# EAGLE design Controller_high_power_v1.0 (EAGLE 9.3.0)

## Sheet 1 of 2
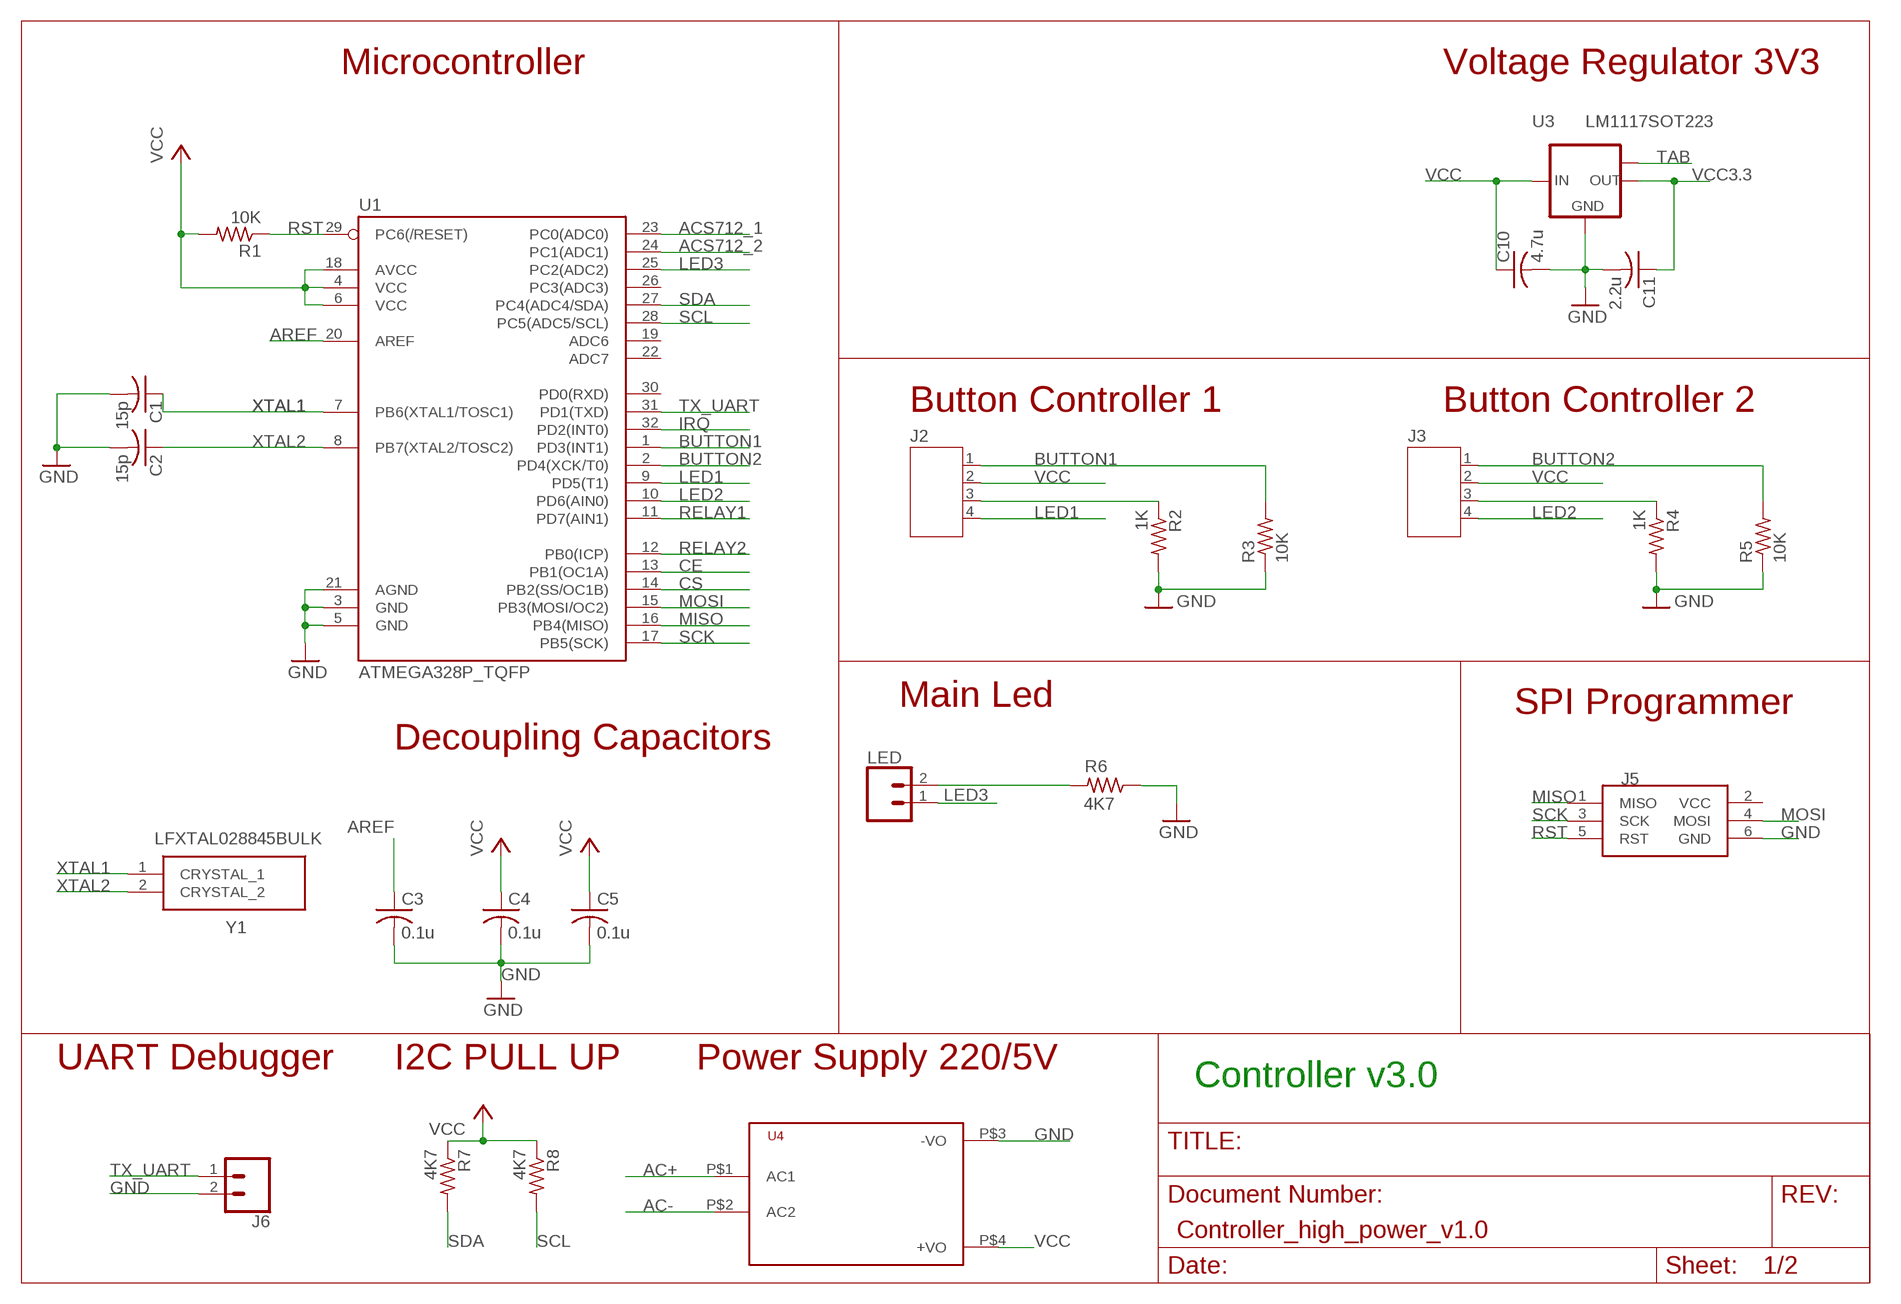
[diagram p0: schematic, sheet 1]

### Parts
C1  15p  CAPACITOR-SMD-0805  [SMD-0805]
C2  15p  CAPACITOR-SMD-0805  [SMD-0805]
C3  0.1u  CAPACITOR-SMD-0805  [SMD-0805]
C4  0.1u  CAPACITOR-SMD-0805  [SMD-0805]
C5  0.1u  CAPACITOR-SMD-0805  [SMD-0805]
C10  4.7u  CAPACITOR-SMD-0805  [SMD-0805]
C11  2.2u  CAPACITOR-SMD-0805  [SMD-0805]
J2  JST-PH4  [JST-PH4]
J3  JST-PH4  [JST-PH4]
J5  ISP  AVRISP-6  [AVRISP]
J6  CONN_02  [1X02]
LED  CONN_02  [1X02]
R1  10K  RESISTOR-SMD-0805  [SMD-0805]
R2  1K  RESISTOR-SMD-0805  [SMD-0805]
R3  10K  RESISTOR-SMD-0805  [SMD-0805]
R4  1K  RESISTOR-SMD-0805  [SMD-0805]
R5  10K  RESISTOR-SMD-0805  [SMD-0805]
R6  4K7  RESISTOR-SMD-0805  [SMD-0805]
R7  4K7  RESISTOR-SMD-0805  [SMD-0805]
R8  4K7  RESISTOR-SMD-0805  [SMD-0805]
U1  ATMEGA328P_TQFP  [TQFP32-08]
U3  LM1117SOT223  LM1117MPX-3.3  [SOT223]
U4  HKLPM01  [HKLPM01]
Y1  LFXTAL028845BULK  [LFXTAL028845BULK]

### Nets
AC+ [ACnet]: U4.P$1(AC1) ; also sheet 2
AC- [ACnet]: U4.P$2(AC2) ; also sheet 2
ACS712_1: U1.23(PC0(ADC0)) ; also sheet 2
ACS712_2: U1.24(PC1(ADC1)) ; also sheet 2
AREF: C3.1 U1.20(AREF)
BUTTON1: J2.1 R3.2 U1.1(PD3(INT1))
BUTTON2: J3.1 R5.2 U1.2(PD4(XCK/T0))
CE: U1.13(PB1(OC1A)) ; also sheet 2
CS: U1.14(PB2(SS/OC1B)) ; also sheet 2
GND: C1.2 C2.2 C3.2 C4.2 C5.2 C10.2 C11.2 J5.6(GND) J6.2 R2.2 R3.1 R4.2 R5.1 R6.1 U1.3(GND) U1.5(GND) U1.21(AGND) U3.1(GND) U4.P$3(-VO) ; also sheet 2
IRQ: U1.32(PD2(INT0)) ; also sheet 2
LED1: J2.4 U1.9(PD5(T1))
LED2: J3.4 U1.10(PD6(AIN0))
LED3: LED.1 U1.25(PC2(ADC2))
MISO: J5.1(MISO) U1.16(PB4(MISO)) ; also sheet 2
MOSI: J5.4(MOSI) U1.15(PB3(MOSI/OC2)) ; also sheet 2
N$8: LED.2 R6.2
N$9: J2.3 R2.1
N$11: J3.3 R4.1
RELAY1: U1.11(PD7(AIN1)) ; also sheet 2
RELAY2: U1.12(PB0(ICP)) ; also sheet 2
RST: J5.5(RST) R1.1 U1.29(PC6(/RESET))
SCK: J5.3(SCK) U1.17(PB5(SCK)) ; also sheet 2
SCL: R8.2 U1.28(PC5(ADC5/SCL)) ; also sheet 2
SDA: R7.2 U1.27(PC4(ADC4/SDA)) ; also sheet 2
TAB: U3.TAB(OUT1)
TX_UART: J6.1 U1.31(PD1(TXD))
VCC: C4.1 C5.1 C10.1 J2.2 J3.2 R1.2 R7.1 R8.1 U1.4(VCC) U1.6(VCC) U1.18(AVCC) U3.3(IN) U4.P$4(+VO) ; also sheet 2
VCC3.3: C11.1 U3.2(OUT) ; also sheet 2
XTAL1: C1.1 U1.7(PB6(XTAL1/TOSC1)) Y1.1(CRYSTAL_1)
XTAL2: C2.1 U1.8(PB7(XTAL2/TOSC2)) Y1.2(CRYSTAL_2)
Unconnected: U1.19(ADC6) U1.22(ADC7) U1.26(PC3(ADC3)) U1.30(PD0(RXD))

### Notes on the sheet
- Microcontroller | Voltage Regulator 3V3
- Button Controller 1 | Button Controller 2
- Main Led | SPI Programmer
- Decoupling Capacitors
- UART Debugger | I2C PULL UP | Power Supply 220/5V
- Controller v3.0

## Sheet 2 of 2
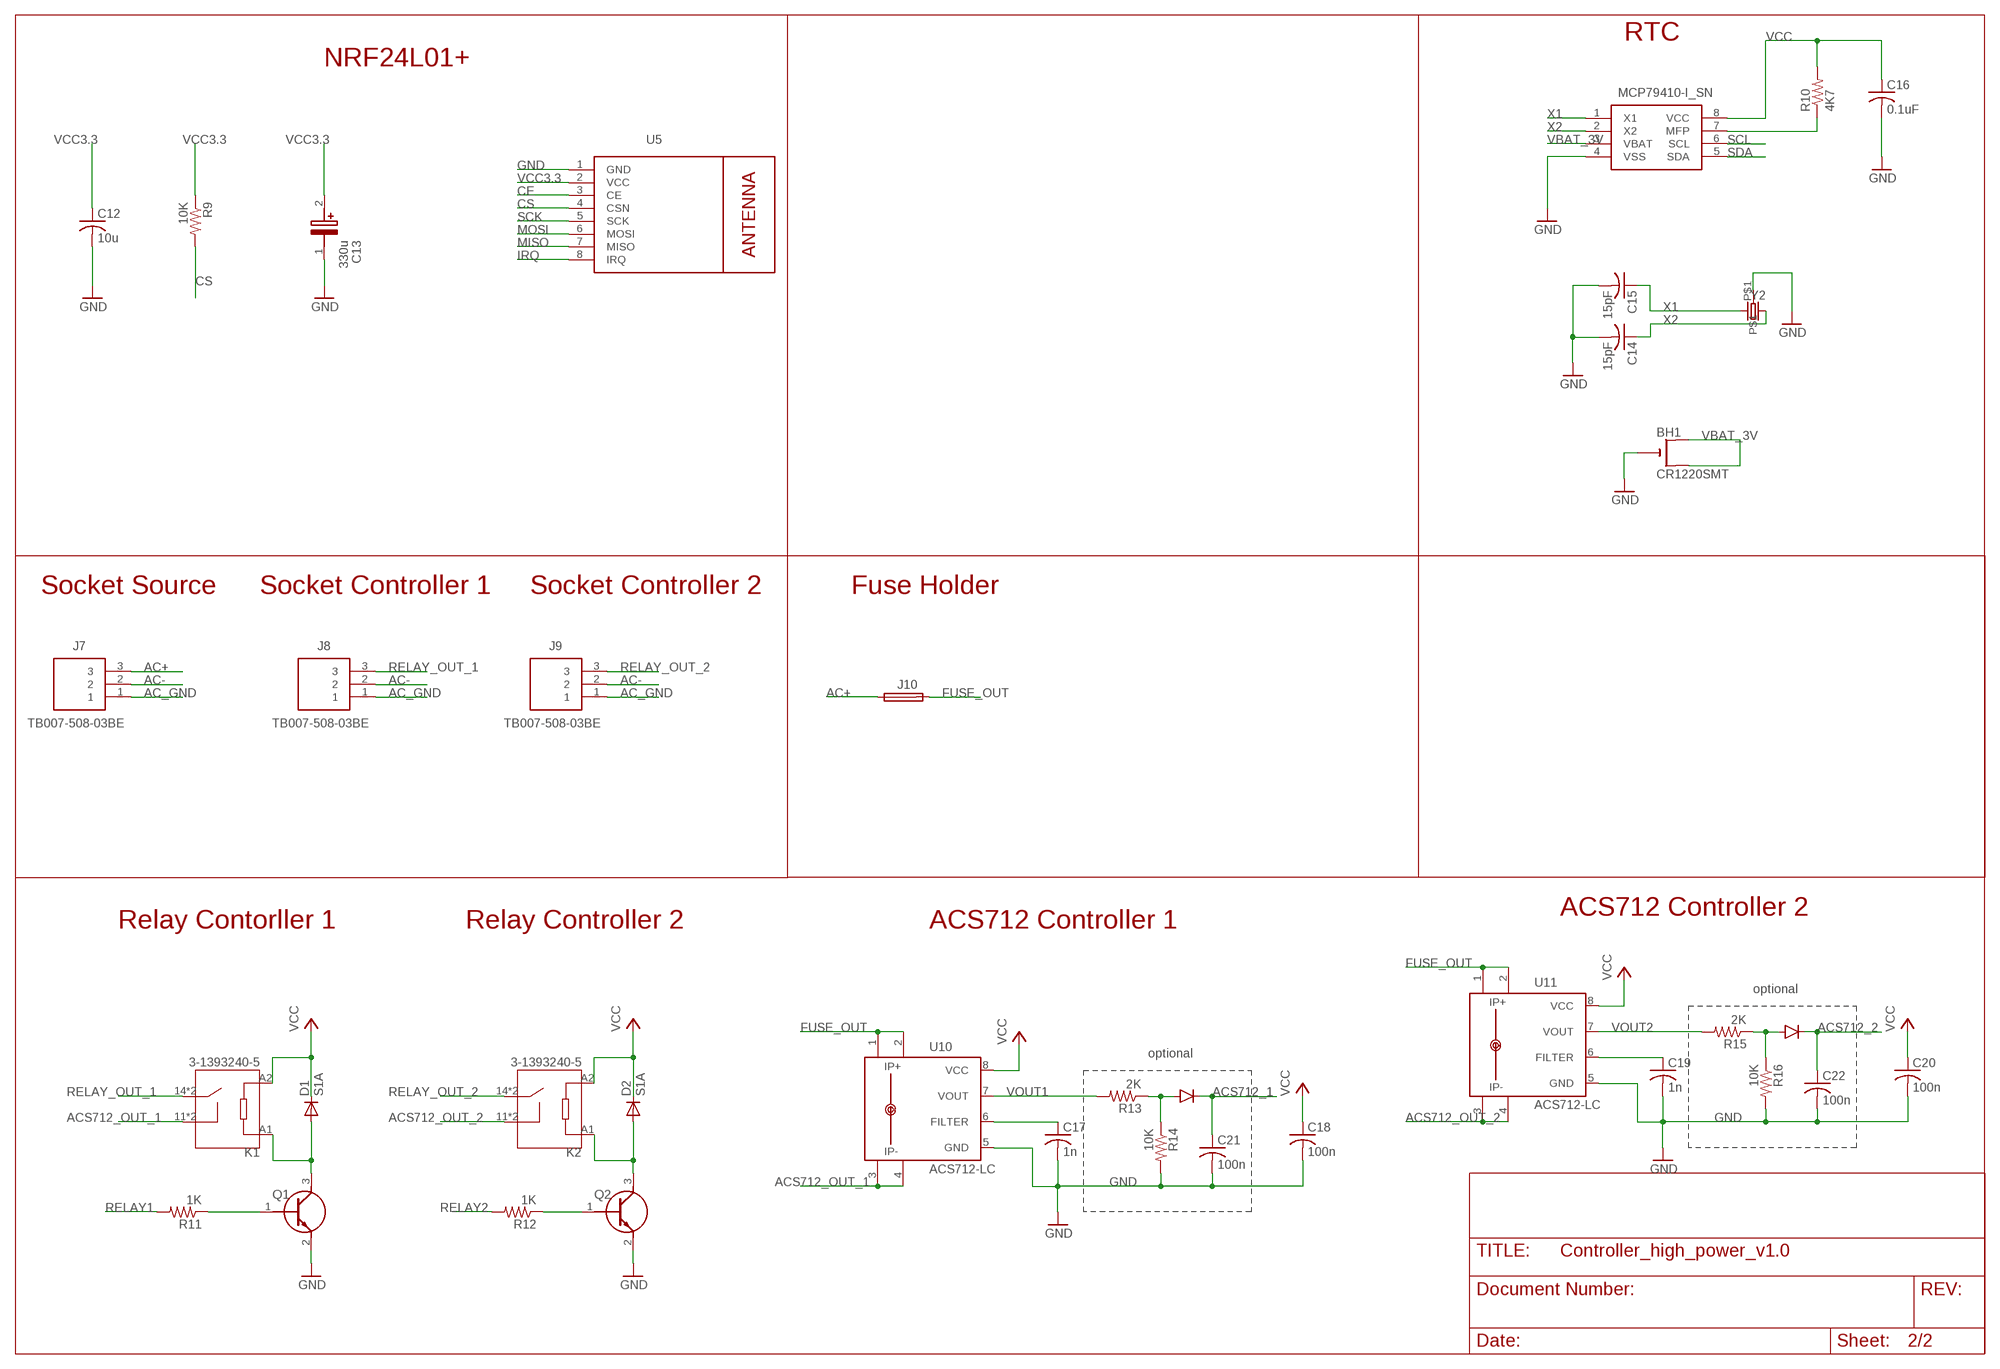
[diagram p1: schematic, sheet 2]

### Parts
BH1  CR1220SMT  [CR1220-SMD]
C12  10u  CAPACITOR-SMD-0805  [SMD-0805]
C13  330u  EEE-FNC271XUP  [SMD_LYTIC_D8]
C14  15pF  CAPACITOR-SMD-0805  [SMD-0805]
C15  15pF  CAPACITOR-SMD-0805  [SMD-0805]
C16  0.1uF  CAPACITOR-SMD-0805  [SMD-0805]
C17  1n  CAPACITOR-SMD-0805  [SMD-0805]
C18  100n  CAPACITOR-SMD-0805  [SMD-0805]
C19  1n  CAPACITOR-SMD-0805  [SMD-0805]
C20  100n  CAPACITOR-SMD-0805  [SMD-0805]
C21  100n  CAPACITOR-SMD-0805  [SMD-0805]
C22  100n  CAPACITOR-SMD-0805  [SMD-0805]
D1  S1A  [DO214AC]
D2  S1A  [DO214AC]
D3  DIODE  [SOD-323]
D4  DIODE  [SOD-323]
J7  TB007-508-03BE  [TB00750803BE]
J8  TB007-508-03BE  [TB00750803BE]
J9  TB007-508-03BE  [TB00750803BE]
J10  SH22,5A  [SH22,5A]
K1  3-1393240-5  [TE_3-1393240-5]
K2  3-1393240-5  [TE_3-1393240-5]
Q1  MMBT2222A-TP  [SI2305TP]
Q2  MMBT2222A-TP  [SI2305TP]
R9  10K  RESISTOR-SMD-0805  [SMD-0805]
R10  4K7  RESISTOR-SMD-0805  [SMD-0805]
R11  1K  RESISTOR-SMD-0805  [SMD-0805]
R12  1K  RESISTOR-SMD-0805  [SMD-0805]
R13  2K  RESISTOR-SMD-0805  [SMD-0805]
R14  10K  RESISTOR-SMD-0805  [SMD-0805]
R15  2K  RESISTOR-SMD-0805  [SMD-0805]
R16  10K  RESISTOR-SMD-0805  [SMD-0805]
U5  WIRELESS-NRF24L01  [WIRELESS-NRF24L01]
U6  MCP79410-I_SN  [SOIC127P600X175-8N]
U10  ACS712-LC  [SOIC8]
U11  ACS712-LC  [SOIC8]
Y2  CRYSTALTC26H  [TC26H]

### Nets
AC+ [ACnet]: J7.3 J10.1 ; also sheet 1
AC- [ACnet]: J7.2 J8.2 J9.2 ; also sheet 1
AC_GND: J7.1 J8.1 J9.1
ACS712_1: C21.1 D3.C ; also sheet 1
ACS712_2: C22.1 D4.C ; also sheet 1
ACS712_OUT_1: K1.11 K1.11-1 U10.3(IP-) U10.4(IP-1)
ACS712_OUT_2: K2.11 K2.11-1 U11.3(IP-) U11.4(IP-1)
CE: U5.3(CE) ; also sheet 1
CS: R9.2 U5.4(CSN) ; also sheet 1
FUSE_OUT: J10.2 U10.1(IP+) U10.2(IP+1) U11.1(IP+) U11.2(IP+1)
GND: BH1.- C12.2 C13.1 C14.2 C15.2 C16.2 C17.2 C18.2 C19.2 C20.2 C21.2 C22.2 Q1.2(E) Q2.2(E) R14.2 R16.2 U5.1(GND) U6.4(VSS) U10.5(GND) U11.5(GND) Y2.P$1 ; also sheet 1
IRQ: U5.8(IRQ) ; also sheet 1
MISO: U5.7(MISO) ; also sheet 1
MOSI: U5.6(MOSI) ; also sheet 1
N$1: Q2.1(B) R12.1
N$2: D2.A K2.A1 Q2.3(C)
N$3: D1.A K1.A1 Q1.3(C)
N$4: C19.1 U11.6(FILTER)
N$5: C17.1 U10.6(FILTER)
N$6: Q1.1(B) R11.1
N$7: D4.A R15.1 R16.1
N$10: D3.A R13.1 R14.1
N$16: R10.1 U6.7(MFP)
RELAY1: R11.2 ; also sheet 1
RELAY2: R12.2 ; also sheet 1
RELAY_OUT_1: J8.3 K1.14 K1.14-1
RELAY_OUT_2: J9.3 K2.14 K2.14-1
SCK: U5.5(SCK) ; also sheet 1
SCL: U6.6(SCL) ; also sheet 1
SDA: U6.5(SDA) ; also sheet 1
VBAT_3V: BH1.+$1(+) BH1.+$2(+1) U6.3(VBAT)
VCC: C16.1 C18.1 C20.1 D1.C D2.C K1.A2 K2.A2 R10.2 U6.8(VCC) U10.8(VCC) U11.8(VCC) ; also sheet 1
VCC3.3: C12.1 C13.2 R9.1 U5.2(VCC) ; also sheet 1
VOUT1: R13.2 U10.7(VOUT)
VOUT2: R15.2 U11.7(VOUT)
X1: C15.1 U6.1(X1) Y2.2
X2: C14.1 U6.2(X2) Y2.1

### Notes on the sheet
- RTC
- NRF24L01+
- Socket Source | Socket Controller 1 | Socket Controller 2 | Fuse Holder
- ACS712 Controller 2
- Relay Contorller 1 | Relay Controller 2 | ACS712 Controller 1
- optional
- optional

## Power pins joined to a net without a drawn wire
VCC: J5.2(VCC)

## Library data of the parts
BH1 = CR1220:CR1220: CR1216/CR1220/CR1225 12mm 3V lithium coin cell Great for battery packup. Both SMT and THM holders. Note the THM package has the ground pads on both sides of the PCB so that the masks are the same - this reduces the cost Check prices <https://pricing.snapeda.com/parts/CR1220/FDK%20America%2C/view-part?ref=eda>; AVAILABILITY: In Stock; DESCRIPTION: Button cell battery, Lithium, 3 V, 35 mAh | VARTA CR1220 (Button cell battery, Lithium, 3 V, 35 mAh Standard Batteries).; MF: FDK America,; MP: CR1220; PACKAGE: Varta; PRICE: None
C1-C5 C10-C12 C14-C22 = Fuzzy:CAPACITOR-SMD-0805
C13 = SamacSys_Parts:EEE-FNC271XUP: PANASONIC - EEE-FNC271XUP - CAP, 270UF, 16V, ALU ELEC, SMD Source: Datasheet <http://industrial.panasonic.com/cdbs/www-data/pdf/RDE0000/RDE0000C1259.pdf>; DESCRIPTION: PANASONIC - EEE-FNC271XUP - CAP, 270UF, 16V, ALU ELEC, SMD; HEIGHT: 7.8mm; MANUFACTURER_NAME: Panasonic; MANUFACTURER_PART_NUMBER: EEE-FNC271XUP; MOUSER_PART_NUMBER: 667-EEE-FNC271XUP; MOUSER_PRICE-STOCK: https://www.mouser.co.uk/ProductDetail/Panasonic/EEE-FNC271XUP?qs=OlC7AqGiEDk4Wtbs6TVCqQ%3D%3D
D1 D2 = s1x_10:S1*: S1A - S1M General Purpose Rectifiers Source: http://www.fairchildsemi.com/datasheets/S1/S1A.pdf; MF: Fairchild; MPN: S1A; OC_FARNELL: 9843868; OC_NEWARK: 58K9551
D3 D4 = Fuzzy:DIODE
J2 J3 = jst-ph:JST-PH4
J5 = adafruit:AVRISP: AVR ISP HEADER Standard 6 pin header for AVR programming
J6 LED = SparkFun-Connectors:CONN_02: Multi connection point. Often used as Generic Header-pin footprint for 0.1 inch spaced/style header connections On any of the 0.1 inch spaced packages, you can populate with these: Break Away Headers - Straight <https://www.sparkfun.com/products/116> (PRT-00116) Break Away Male Headers - Right Angle <https://www.sparkfun.com/products/553> (PRT-00553) Female Headers <https://www.sparkfun.com/products/115> (PRT-00115) Break Away Headers - Machine Pin <https://www.sparkfun.com/products/117> (PRT-00117) Break Away Female Headers - Swiss Machine Pin <https://www.sparkfun.com/products/743> (PRT-00743) For SCREWTERMINALS and SPRING TERMINALS visit here: Screw Terimnals on SparkFun.com <https://www.sparkfun.com/search/results?term=Screw+Terminals> (5mm/3.5mm/2.54mm spacing) This device is also useful as a general connection point to wire up your design to another part of your project. Our various solder wires solder well into these plated through hole pads. Hook-Up Wire - Assortment (Stranded, 22 AWG) <https://www.sparkfun.com/products/11375> (PRT-11375) Hook-Up Wire - Assortment (Solid Core, 22 AWG) <https://www.sparkfun.com/products/11367> (PRT-11367) View the entire wire category on our website here <https://www.sparkfun.com/categories/141> Special notes: Molex polarized connector foot print use with: PRT-08233 with associated crimp pins and housings. 2.54_SCREWTERM for use with PRT-10571. 3.5mm Screw Terminal footprints for PRT-08084 5mm Screw Terminal footprints for use with PRT-08432
J7-J9 = SamacSys_Parts:TB007-508-03BE: Fixed Terminal Blocks Terminal block, screw type, 5.08 , horizontal, 3 poles, CUI Blue, slotted screw, PCB mount Source: Datasheet; DESCRIPTION: Fixed Terminal Blocks Terminal block, screw type, 5.08 , horizontal, 3 poles, CUI Blue, slotted screw, PCB mount; HEIGHT: 14.4mm; MANUFACTURER_NAME: CUI Inc.; MANUFACTURER_PART_NUMBER: TB007-508-03BE; MOUSER_PART_NUMBER: 490-TB007-508-03BE; MOUSER_PRICE-STOCK: https://www.mouser.co.uk/ProductDetail/CUI-Devices/TB007-508-03BE?qs=vLWxofP3U2zHYiGqNs1vAA%3D%3D
J10 = fuse:SH22,5A: FUSE HOLDER grid 22,5mm, isolated cap OGN0031 8201, Schurter (Buerklin); MPN: 0031.7701.11; OC_FARNELL: unknown; OC_NEWARK: 04F1224
K1 K2 = 3-1393240-5:3-1393240-5: Electromechanical Relay 24VDC 1.44KOhm 16A SPST-NO (29x12.7x15.7)mm THT Power Relay; AVAILABILITY: Unavailable; COMMENT: 3-1393240-5; DESCRIPTION: Electromechanical Relay 24VDC 1.44KOhm 16A SPST-NO _29x12.7x15.7_mm THT Power Relay; MF: TE Connectivity; MP: 3-1393240-5; PACKAGE: None; PRICE: None; TE_PURCHASE_URL: https://www.te.com/usa-en/product-3-1393240-5.html?te_bu=Cor&te_type=disp&te_campaign=seda_glo_cor-seda-global-disp-prtnr-fy19-seda-model-bom-cta_sma-317_1&elqCampaignId=32493
Q1 Q2 = SamacSys_Parts:MMBT2222A-TP: MICRO COMMERCIAL COMPONENTS - MMBT2222A-TP - BJT, NPN, 40VDC, SOT-23 Source: Datasheet <https://datasheet.datasheetarchive.com/originals/distributors/Datasheets_SAMA/282e04cdf1a526471339103510be6d53.pdf>; DESCRIPTION: MICRO COMMERCIAL COMPONENTS - MMBT2222A-TP - BJT, NPN, 40VDC, SOT-23; HEIGHT: mm; MANUFACTURER_NAME: Micro Commercial Components (MCC); MANUFACTURER_PART_NUMBER: MMBT2222A-TP; MOUSER_PART_NUMBER: 833-MMBT2222A-TP; MOUSER_PRICE-STOCK: https://www.mouser.co.uk/ProductDetail/Micro-Commercial-Components-MCC/MMBT2222A-TP?qs=KFo7JewZbUE%252BJc5W0eD55w%3D%3D
R1-R16 = Fuzzy:RESISTOR-SMD-0805
U1 = SparkFun-IC-Microcontroller:ATMEGA328P_TQFP: Popular 328P in QFP Storefront component: ATmega328 - TQFP <https://www.sparkfun.com/products/13448> (COM-13448) Datasheet <http://www.sparkfun.com/datasheets/Components/SMD/ATMega328.pdf> SparkFun Products SparkFun RedBoard - Programmed with Arduino <https://www.sparkfun.com/products/12757> (DEV-12757) Arduino Pro Mini 328 - 5V/16MHz <https://www.sparkfun.com/products/11113> (DEV-11113) Arduino Pro Mini 328 - 3.3V/8MHz <https://www.sparkfun.com/products/11114> (DEV-11114) SparkFun OpenLog <https://www.sparkfun.com/products/13712> (DEV-13712) SparkFun MicroView - OLED Arduino Module <https://www.sparkfun.com/products/12923> (DEV-12923) SparkFun Digital Sandbox <https://www.sparkfun.com/products/12651> (DEV-12651) SparkFun PicoBoard <https://www.sparkfun.com/products/11888> (WIG-11888) Arduino Fio <https://www.sparkfun.com/products/10116> (DEV-10116) LilyPad Arduino 328 Main Board <https://www.sparkfun.com/products/13342> (DEV-13342) SparkFun RedStick <https://www.sparkfun.com/products/13741> (DEV-13741) LilyPad MP3 <https://www.sparkfun.com/products/11013> (DEV-11013) LilyPad Arduino SimpleSnap <https://www.sparkfun.com/products/10941> (DEV-10941) SparkFun Stepoko <https://www.sparkfun.com/products/13899> (ROB-13899) SparkFun Geiger Counter <https://www.sparkfun.com/products/11345> (SEN-11345) SparkFun EL Sequencer <https://www.sparkfun.com/products/12781> (COM-12781) Arduino Pro 328 - 5V/16MHz <https://www.sparkfun.com/products/10915> (DEV-10915) CryptoCape <https://www.sparkfun.com/products/12773> (DEV-12773) SparkFun IR Thermometer Evaluation Board - MLX90614 <https://www.sparkfun.com/products/10740> (SEN-10740) SparkFun RedBot Mainboard <https://www.sparkfun.com/products/12097> (ROB-12097) Arduino Pro 328 - 3.3V/8MHz <https://www.sparkfun.com/products/10914> (DEV-10914) SparkFun Block for Intel® Edison - Arduino <https://www.sparkfun.com/products/13036> (DEV-13036) SparkFun Simon Says - Surface Mount Soldering Kit <https://www.sparkfun.com/products/10935> (KIT-10935) SparkFun 7-Segment Serial Display - Red <https://www.sparkfun.com/products/11441> (COM-11441) SparkFun 7-Segment Serial Display - White <https://www.sparkfun.com/products/11629> (COM-11629) SparkFun 7-Segment Serial Display - Yellow <https://www.sparkfun.com/products/11443> (COM-11443) SparkFun 7-Segment Serial Display - Kelly Green <https://www.sparkfun.com/products/11440> (COM-11440) SparkFun 7-Segment Serial Display - Blue <https://www.sparkfun.com/products/11442> (COM-11442) SparkFun OpenSegment Serial Display - 20mm (Blue) <https://www.sparkfun.com/products/11647> (COM-11647) SparkFun OpenSegment Serial Display - 20mm (Green) <https://www.sparkfun.com/products/11646> (COM-11646) SparkFun OpenSegment Serial Display - 20mm (White) <https://www.sparkfun.com/products/11648> (COM-11648) SparkFun OpenSegment Serial Display - 20mm (Red) <https://www.sparkfun.com/products/11644> (COM-11644) SparkFun OpenSegment Serial Display - 20mm (Yellow) <https://www.sparkfun.com/products/11645> (COM-11645) SparkFun OpenSegment Shield <https://www.sparkfun.com/products/13190> (DEV-13190); PROD_ID: IC-09069
U3 = lm1117:LM1117MPX-*
U4 = HLKPM01EaglesLib:HKLPM01
U5 = diy-modules:WIRELESS-NRF24L01: 2.4 GHz Wireless Module based on NRF24L01 chip More details available here: http://www.electrodragon.com/w/NRF24L01 Click here to find device on ebay.com <http://www.ebay.com/sch/nrf24l01+arduino>
U6 = SamacSys_Parts:MCP79410-I_SN: I2C GP RTCC, 1Kb EE, 64B SRAM, ID Source: Datasheet <https://componentsearchengine.com/Datasheets/1/MCP79410-I_SN.pdf>; DESCRIPTION: I2C GP RTCC, 1Kb EE, 64B SRAM, ID; HEIGHT: 1.75mm; MANUFACTURER_NAME: Microchip; MANUFACTURER_PART_NUMBER: MCP79410-I/SN; MOUSER_PART_NUMBER: 579-MCP79410-I/SN; MOUSER_PRICE-STOCK: https://www.mouser.com/Search/Refine.aspx?Keyword=579-MCP79410-I%2FSN
U10 U11 = allegro-2:ACS712-LC
Y1 = SamacSys_Parts:LFXTAL028845BULK: Crystals 4MHz 12pF -20C 70C Source: Datasheet; DESCRIPTION: Crystals 4MHz 12pF -20C 70C; HEIGHT: 4.3mm; MANUFACTURER_NAME: IQD; MANUFACTURER_PART_NUMBER: LFXTAL028845BULK
Y2 = adafruit:CRYSTAL: CRYSTAL; OC_FARNELL: unknown; OC_NEWARK: unknown

## Net classes
0 default: width 0.254 mm, drill 0.508 mm, clearance 0.203 mm
1 ACnet: width 1.778 mm, drill 0.508 mm, clearance 0.203 mm

## Board
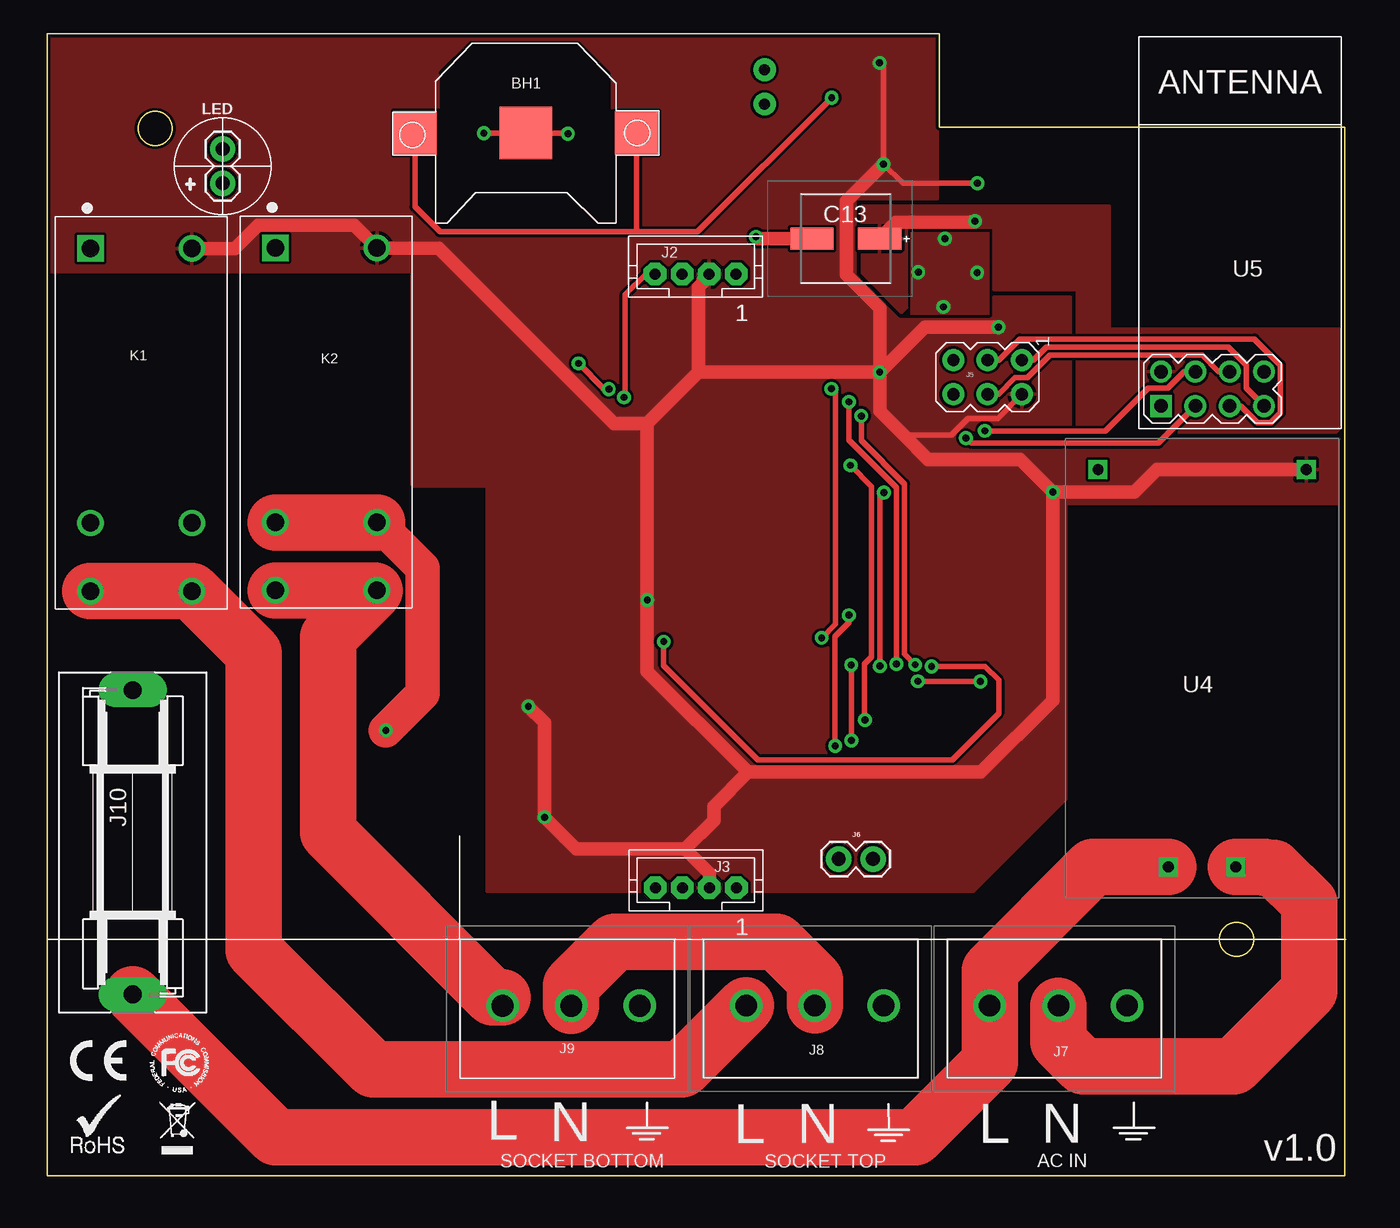
[diagram p2: board, top side]
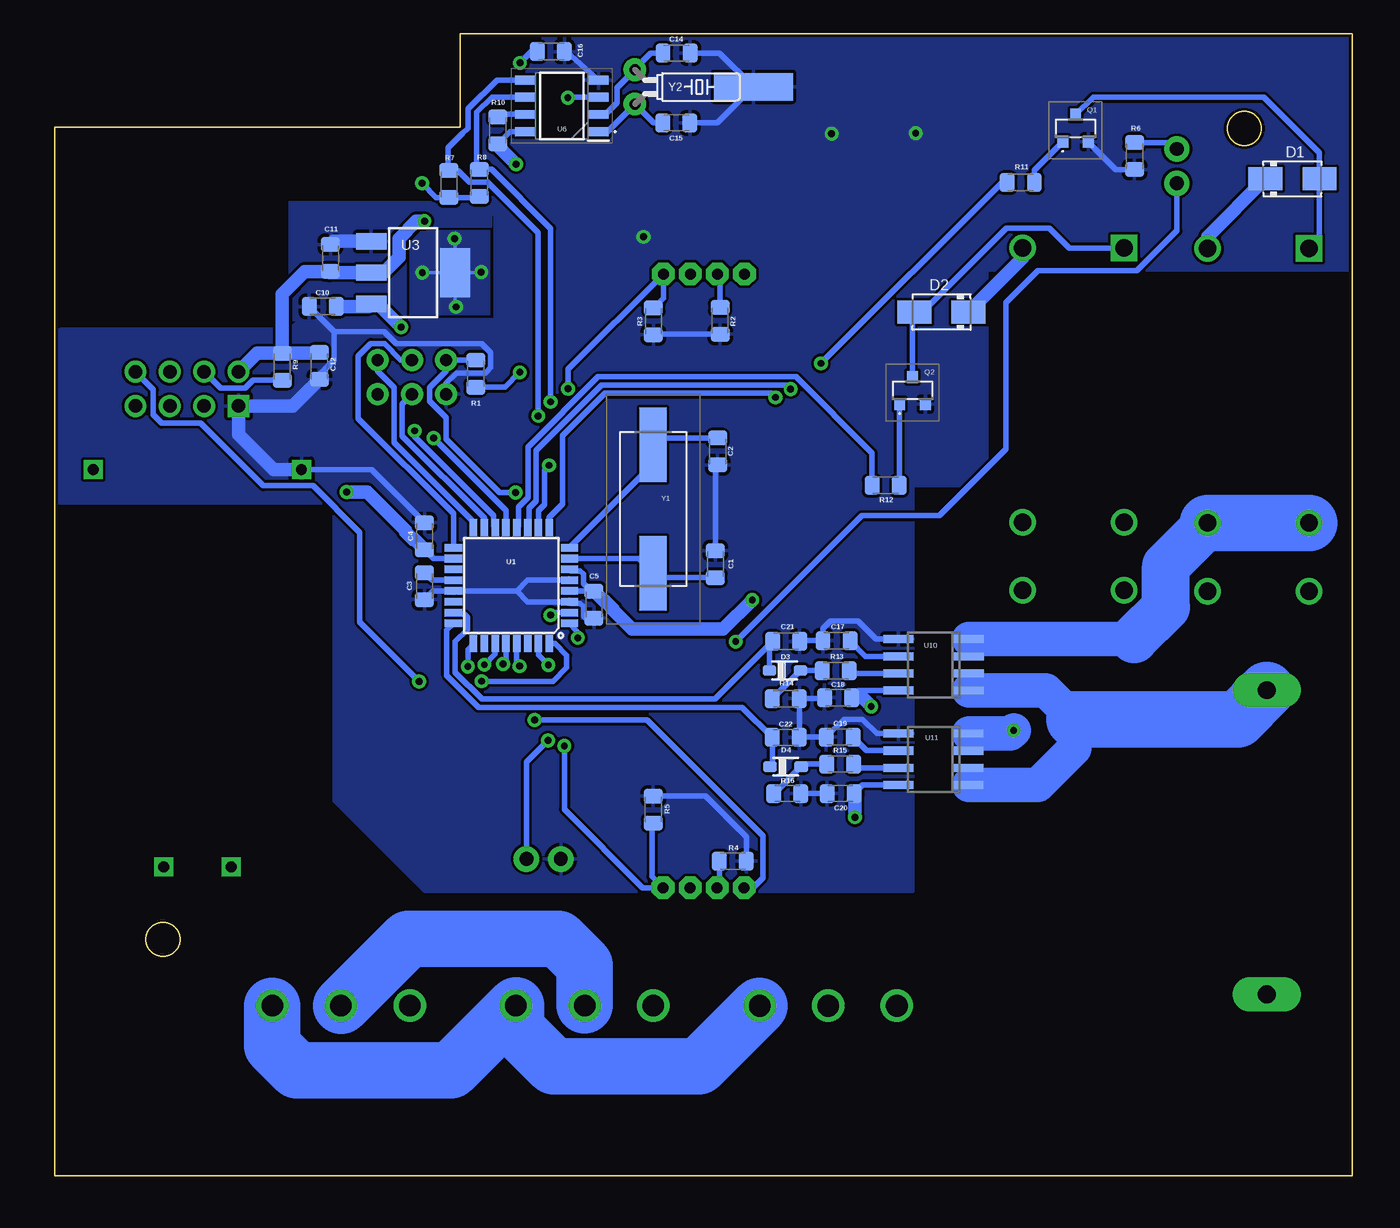
[diagram p3: board, bottom side, seen from below]

Size 96 x 84.5 mm. Coordinates in mm from the lower left corner, seen from the top.
Outline: 0,0 96,0 96,77.6 66,77.6 66,84.5 0,84.5 0,0
Outline: circle at 8,77.5 radius 1.25
Outline: circle at 88,17.5 radius 1.25
Copper layers (1*16): Top 0.035mm / dielectric 1.5mm / Bottom 0.035mm
Design rules "SparkFun": minimum track width 8mil, minimum drill 20mil, track to track 8mil, track to pad 8mil, pad to pad 8mil, via to via 8mil, smd to smd 8mil, copper to edge 8mil, drill to drill 8mil, minimum pad ring 12mil, minimum via ring 10mil, stop-mask expansion 4mil, vias tented up to drill 20mil, thermal gap 10mil

### Footprints (pad centres in the part's own frame; a part is rotated, then mirrored left to right if it is on the bottom)
CR1220-SMD = smd 3.2 x 3.2: +$1 -8.2,0; +$2 8.2,0 | smd 3.9 x 3.9: - 0,0
SMD-0805 = smd 1.1 x 1.4: 1 -1,0; 2 1,0
SMD_LYTIC_D8 = smd 3.2 x 1.6: 1 -2.5,0; 2 2.5,0
DO214AC = smd 2.5 x 1.7: A 2,0; C -2,0
SOD-323 = smd 1 x 0.8: A 1.15,0; C -1.15,0
JST-PH4 = drill 0.813 pad 1.676 octagon: 1 3,0; 2 1,0; 3 -1,0; 4 -3,0
AVRISP = drill 0.9 pad 1.626: 1 -1.27,2.54; 2 1.27,2.54; 3 -1.27,0; 4 1.27,0; 5 -1.27,-2.54; 6 1.27,-2.54
1X02 = drill 1.016 pad 1.88: 1 0,0; 2 2.54,0
TB00750803BE = drill 1.6 pad 2.4: 1 0,0; 2 5.08,0; 3 10.16,0
SH22,5A = drill 1.321 pad 2.54 long: 1 -11.252,0; 2 11.252,0
TE_3-1393240-5 = drill 1.3: 11 20.3,-3.75; 11-1 20.3,3.75; 14 25.34,-3.75; 14-1 25.34,3.75; A2 0,3.75 | drill 1.3 square: A1 0,-3.75
SI2305TP = smd 0.8 x 0.9: 1 -0.95,-1; 2 0.95,-1; 3 0,1
TQFP32-08 = smd 1.27 x 0.559: 1 -4.293,2.8; 2 -4.293,2; 3 -4.293,1.2; 4 -4.293,0.4; 5 -4.293,-0.4; 6 -4.293,-1.2; 7 -4.293,-2; 8 -4.293,-2.8; 17 4.293,-2.8; 18 4.293,-2; 19 4.293,-1.2; 20 4.293,-0.4; 21 4.293,0.4; 22 4.293,1.2; 23 4.293,2; 24 4.293,2.8 | smd 0.559 x 1.27: 9 -2.8,-4.293; 10 -2,-4.293; 11 -1.2,-4.293; 12 -0.4,-4.293; 13 0.4,-4.293; 14 1.2,-4.293; 15 2,-4.293; 16 2.8,-4.293; 25 2.8,4.293; 26 2,4.293; 27 1.2,4.293; 28 0.4,4.293; 29 -0.4,4.293; 30 -1.2,4.293; 31 -2,4.293; 32 -2.8,4.293
SOT223 = smd 1.219 x 2.235: 1 -2.311,-3.099; 2 0,-3.099; 3 2.311,-3.099 | smd 3.6 x 2.2: TAB 0,3.099
HKLPM01 = drill 0.8 square: P$1 -14.7,2.5; P$2 -14.7,-2.5; P$3 14.7,7.7; P$4 14.7,-7.7
WIRELESS-NRF24L01 = drill 1 square: 1 -12.7,6.35 | drill 1: 2 -10.16,6.35; 3 -12.7,3.81; 4 -10.16,3.81; 5 -12.7,1.27; 6 -10.16,1.27; 7 -12.7,-1.27; 8 -10.16,-1.27
SOIC127P600X175-8N = smd 1.525 x 0.65: 1 -2.712,1.905; 2 -2.712,0.635; 3 -2.712,-0.635; 4 -2.712,-1.905; 5 2.712,-1.905; 6 2.712,-0.635; 7 2.712,0.635; 8 2.712,1.905
SOIC8 = smd 0.6 x 2.2: 1 -1.905,-2.6; 2 -0.635,-2.6; 3 0.635,-2.6; 4 1.905,-2.6; 5 1.905,2.6; 6 0.635,2.6; 7 -0.635,2.6; 8 -1.905,2.6
LFXTAL028845BULK = smd 5.5 x 2: 1 -4.75,0; 2 4.75,0
TC26H = drill 0.813 pad 1.676: 1 -1.27,0; 2 1.27,0 | smd 2.032 x 5.842: P$1 0,8.763

### Placement (x,y rotation side)
BH1  35.42,77.16 180 top
C1  47.12,45.26 90 bottom
C2  46.96,53.6 270 bottom
C3  68.64,43.64 270 bottom
C4  68.64,47.34 90 bottom
C5  56.11,42.27 270 bottom
C10  76.17,64.33 180 bottom
C11  75.6,67.91 90 bottom
C12  76.43,59.93 270 bottom
C13  59.09,69.34 0 top
C14  50,83.07 0 bottom
C15  50.01,77.92 0 bottom
C16  59.3,83.19 0 bottom
C17  38.17,39.6 180 bottom
C18  38.05,35.39 180 bottom
C19  37.94,32.47 180 bottom
C20  37.87,28.3 180 bottom
C21  41.89,39.56 0 bottom
C22  41.92,32.45 0 bottom
D1  4.44,73.77 0 bottom
D2  30.4,63.91 180 bottom
D3  41.99,37.4 0 bottom
D4  41.93,30.29 0 bottom
J2  47.98,66.73 0 top
J3  48,21.32 0 top
J5  69.58,59.1 270 top
J6  61.1,23.45 180 top
J7  79.9,12.6 180 top
J8  61.88,12.61 180 top
J9  43.86,12.59 180 top
J10  6.34,24.69 90 top
K1  6.96,68.61 270 top
K2  20.65,68.66 270 top
LED  12.99,73.44 90 top
Q1  20.48,77.51 0 bottom
Q2  32.54,58.11 0 bottom
R1  64.85,59.36 270 bottom
R2  46.78,63.27 270 bottom
R3  51.71,63.23 90 bottom
R4  45.84,23.3 0 bottom
R5  51.73,27.11 270 bottom
R6  16.12,75.45 90 bottom
R7  66.83,73.39 90 bottom
R8  64.59,73.47 90 bottom
R9  79.17,59.87 270 bottom
R10  63.22,77.35 270 bottom
R11  24.53,73.5 180 bottom
R12  34.53,51.09 180 bottom
R13  38.22,37.38 0 bottom
R14  41.92,35.31 0 bottom
R15  37.88,30.48 0 bottom
R16  41.8,28.3 0 bottom
U1  62.22,43.68 180 bottom
U3  69.48,66.83 270 bottom
U4  85.45,37.56 90 top
U5  88.76,69.66 90 top
U6  58.49,79.17 180 bottom
U10  30.98,37.81 90 bottom
U11  30.99,30.83 90 bottom
Y1  51.73,49.34 90 bottom
Y2  53.08,80.57 270 bottom

### Tracks (layer width: path | path; a pad name or v marks a point on that pad's centre or on a via)
AC+
  Top 4.191: U4.P$1 77.38,22.86 69.74,15.22 J7.3 69.74,8.42 64.19,2.87 16.91,2.87 J10.1
AC-
  Top 4.191: U4.P$2 90.08,22.86 90.13,22.81 90.76,22.81 93.36,20.21 93.36,13.7 87.78,8.12 76.61,8.12 74.82,9.91 J7.2 | J8.2 56.8,14.52 54,17.32 41.99,17.32 38.78,14.11 J9.2
  Bottom 4.191: J8.2 56.8,15.61 58.74,17.55 69.87,17.55 J7.2
AC_GND
  Bottom 4.191: J7.1 79.9,9.62 78.09,7.81 66.68,7.81 J8.1 61.88,10.88 59.11,8.11 48.34,8.11 J9.1
ACS712_1
  Bottom 0.406: D3.C 43.14,39.31 C21.1 47.17,35.28 64.4,35.28 66.38,37.26 66.38,39.52 65.47,40.43 65.47,41.33 65.71,41.57 66.4,41.57 U1.23
ACS712_2
  Bottom 0.406: D4.C 42.92,30.45 C22.1 45.14,34.67 64.65,34.67 67.01,37.03 67.01,40.38 U1.24
ACS712_OUT_1
  Bottom 0.406: U10.4 U10.3
  Bottom 2.54: U10.4 16.16,39.72 | 10.71,48.23 K1.11-1
  Bottom 3.556: 16.16,39.72 13.8,42.07 13.8,45.14 10.71,48.23
  Bottom 4.191: K1.11 K1.11-1
ACS712_OUT_2  (via drill 0.51)
  Top 2.54: v25.06,32.97 27.79,35.7 27.79,44.97 K2.11-1
  Top 4.191: K2.11 K2.11-1
  Bottom 0.406: U11.3 U11.4
  Bottom 2.54: U11.4 25.3,32.73 v25.06,32.97
AREF
  Bottom 0.406: U1.20 68.08,44.08 C3.1
BUTTON1  (via drill 0.51)
  Top 0.406: v57.31,39.81 58.34,40.84 58.34,57.94 v58.03,58.24
  Bottom 0.406: v58.03,58.24 58.03,59.68 J2.1 50.98,64.96 R3.2 | U1.1 57.31,40.26 v57.31,39.81
BUTTON2  (via drill 0.51)
  Top 0.406: v58.3,31.82 58.3,39.92 59.33,40.95 v59.33,41.49
  Bottom 0.406: U1.2 59.14,41.68 v59.33,41.49 | R5.2 51.83,26.01 51.83,22.16 J3.1 52.5,21.32 58.3,27.12 v58.3,31.82
CE  (via drill 0.51)
  Top 0.406: v67.98,54.6 68.37,54.21 69.75,54.21 69.76,54.22 82.21,54.22 U5.3
  Bottom 0.406: U1.13 62.62,49.23 v67.98,54.6
CS  (via drill 0.51)
  Top 0.406: v69.37,55.13 78.31,55.13 81.47,58.29 82.91,58.29 84.12,59.5 U5.4
  Bottom 0.406: U1.14 63.53,48.09 63.53,48.86 69.37,54.7 v69.37,55.13 | R9.2 81.33,58.87 81.91,58.29 83.74,58.29 U5.4
FUSE_OUT
  Bottom 0.406: U11.2 U11.1 | U10.2 U10.1
  Bottom 2.54: U10.1 22.68,35.91 20.56,33.79 20.56,31.62 23.25,28.93 U11.1
  Bottom 4.191: J10.2 8.49,33.79 20.56,33.79
GND  (via drill 0.51)
  Top 0.406: v38.53,77.11 38.48,77.16 BH1.- v32.32,77.16 v32.31,77.15
  Top 1.016: v52.45,69.48 52.59,69.34 C13.1
  Bottom 0.406: C18.2 39.13,35.31 R14.2 C22.2 40.9,32.47 C19.2 37.62,33.79 36.25,33.79 35.2,32.73 U11.5 | C21.2 40.85,39.6 C17.2 39.17,40.5 38.61,41.06 36.59,41.06 35.24,39.72 U10.5 | C20.2 R16.2 | U6.4 58.14,83.19 C16.2 | C3.2 68,43.28 U1.21 61.81,43.28 | C5.2 56.72,41.27 56.89,41.44 56.89,42.13 57.12,42.37 57.81,42.37 U1.3 61.01,42.48 61.81,43.28 | C1.2 47.12,52.44 C2.2 | R2.2 51.67,62.27 R3.1 | R6.1 17.48,74.45 19.53,76.5 Q1.2 | U1.5 61.01,44.08 61.81,43.28 | C4.2 72.56,52.26 U4.P$3 | R4.2 44.84,25.1 47.85,28.11 R5.1 | C14.2 46.82,83.07 Y2.P$1 46.97,77.92 C15.2 | C12.2 76.43,59.27 75.32,60.37 75.32,62.48 | C10.2 75.32,62.48 | J5.6 67.04,58.65 66.28,59.4 64.14,59.4 63.74,59.8 63.74,60.92 64.42,61.59 70.75,61.59 71.65,62.48 75.32,62.48
  Bottom 1.016: U4.P$3 79.82,52.26 82.41,54.85 U5.1 78.4,56.96 C12.2 | U3.1 75.37,69.14 C11.2
  pour Bottom: 95.67,49.91 95.67,62.57 95.57,62.67 78.57,62.67 77.89,63.35 63.42,63.35 63.42,70.99 63.7,71.27 65.44,71.27 65.52,71.35 65.81,84.01 65.61,84.21 0.34,84.21 0.34,67.01 27.03,67.01 27.05,66.99 27.05,51.1 27.02,51.07 32.49,51.07 32.52,51.04 32.52,21.05 68.58,21.05 68.61,21.02 75.32,27.73 75.32,49.74 75.26,49.8 95.64,49.8 95.69,49.85
  pour Bottom: 63.77,70.15 69.92,70.15 69.99,70.08 69.99,63.29 69.96,63.26 78.67,63.26 78.67,72.11 63.7,72.11 63.7,70.24 63.77,70.17
IRQ  (via drill 0.51)
  Top 0.406: v64.43,36.6 v69.04,36.6 v69.05,36.59
  Bottom 0.406: U5.8 88.7,58.17 88.7,56.32 88.07,55.69 85.19,55.69 80.57,51.07 76.89,51.07 73.43,47.61 73.43,40.97 v69.05,36.59 | U1.32 59,39.39 58.13,38.52 58.13,37.61 59.15,36.59 64.42,36.59 v64.43,36.6
LED1  (via drill 0.51)
  Top 0.406: v42.67,57.61 42.76,57.69 42.76,65.19 44.3,66.73 J2.4
  Bottom 0.406: U1.9 59.42,48.73 58.43,49.72 58.43,54.78 55.3,57.91 42.98,57.91 v42.67,57.61
LED2  (via drill 0.51)
  Top 0.406: v59.43,52.58 61,51.01 61,38.4 60.48,37.89 60.48,33.75 v60.5,33.73
  Bottom 0.406: U1.10 60.22,49.24 59.78,49.68 59.78,52.23 v59.43,52.58 | v60.5,33.73 52.17,33.73 43.61,25.17 43.61,22.05 44.34,21.32 J3.4
LED3  (via drill 0.51)
  Top 0.406: v65.44,37.7 69.38,37.7 70.4,36.68 70.4,34.23 66.96,30.79 52.61,30.79 45.62,37.78 v45.62,39.53
  Bottom 0.406: U1.25 65.44,38.97 v65.44,37.7 | v45.62,39.53 36.3,48.85 30.57,48.85 25.62,53.8 25.62,64.6 23.26,66.96 15.95,66.96 12.99,69.92 LED.1
MISO
  Top 0.406: U5.7 88.7,58.29 88.7,60 87.38,61.32 73.93,61.32 72.98,60.37 J5.1
  Bottom 0.406: J5.1 72.12,59.55 70.9,58.34 70.9,54.25 65.02,48.37 U1.16
MOSI
  Top 0.406: U5.6 86.66,59.5 85.45,60.71 74.19,60.71 72.52,59.05 71.61,59.05 70.4,57.83 J5.4
  Bottom 0.406: J5.4 70.29,57.12 70.29,54.75 64.22,48.68 U1.15
N$1
  Bottom 0.406: Q2.1 33.53,57.07 R12.1
N$2
  Bottom 0.406: K2.A1 20.95,68.66 22.41,70.12 25.61,70.12 31.82,63.91 D2.A 32.54,63.77 Q2.3
N$3
  Bottom 0.406: K1.A1 2.44,69.38 D1.A 2.44,75.7 6.57,79.83 19.16,79.83 Q1.3
N$4
  Bottom 0.406: U11.6 35.94,31.46 C19.1
N$5
  Bottom 0.406: U10.6 36.02,38.45 C17.1
N$6
  Bottom 0.406: Q1.1 23.53,74.41 R11.1
N$7
  Bottom 0.406: R15.1 40.59,30.48 D4.A 42.77,28.3 R16.1
N$8
  Bottom 0.406: R6.2 13.46,76.45 LED.2
N$9
  Bottom 0.406: R2.1 46.78,66.54 J2.3
N$10
  Bottom 0.406: R13.1 40.82,37.38 D3.A R14.1
N$11
  Bottom 0.406: R4.1 46.84,21.48 J3.3
N$16
  Bottom 0.406: U6.7 63.03,78.53 R10.1
NONE
  cutout Top: 29.18,81.57 31.39,83.78 39.24,83.78 41.5,81.52 41.5,70.46 29.27,70.46 29.27,81.57
  cutout Bottom: 56.84,81.6 60.14,81.6 60.17,81.63 60.17,76.82 60.15,76.8 56.95,76.8 56.91,76.76 56.91,81.51 56.85,81.57
RELAY1  (via drill 0.51)
  Top 0.406: v41.56,58.22 41.21,58.22 v39.31,60.12
  Bottom 0.406: U1.11 60.91,48.09 60.91,49.42 60.39,49.93 60.39,53.68 55.55,58.52 41.87,58.52 v41.56,58.22 | v39.31,60.12 25.93,73.5 R11.2
RELAY2
  Bottom 0.406: U1.12 61.71,48.09 61.71,49.48 61,50.18 61,53.93 55.8,59.13 41.16,59.13 35.53,53.5 R12.2
RELAY_OUT_1
  Top 4.191: K1.14 K1.14-1 15.29,38.69 15.29,16.69 24.11,7.87 46.98,7.87 J8.3
RELAY_OUT_2
  Top 1.778: J9.3 33.7,13.21 | K2.14-1 24.22,43.32
  Top 4.191: K2.14 24.22,43.32 20.78,39.88 20.78,25.4 32.98,13.21 33.7,13.21
RST  (via drill 0.51)
  Top 0.406: v61.61,37.72 61.61,50.26 v61.92,50.56
  Bottom 0.406: U1.29 61.82,37.93 v61.61,37.72 | v61.92,50.56 63.08,50.56 67.04,54.52 67.04,56.11 68.26,57.33 68.26,58.34 67.04,59.55 J5.5 R1.1
SCK
  Top 0.406: J5.3 70.4,60.37 71.96,61.93 89.31,61.93 91.24,60 91.24,56.46 90.53,55.75 89.53,55.75 88.32,56.96 U5.5
  Bottom 0.406: U1.17 66.51,49 73.55,56.04 73.55,60.66 72.62,61.59 71.61,61.59 70.4,60.37 J5.3
SCL  (via drill 0.51)
  Top 0.406: v62.83,37.87 62.83,50.94 59.32,54.45 v59.32,57.27
  Bottom 0.406: U6.6 63.66,79.81 64.78,78.69 64.78,74.66 R8.2 63.69,74.47 59.32,70.1 v59.32,57.27 | U1.28 62.62,38.08 v62.83,37.87
SDA  (via drill 0.51)
  Top 0.406: v64.22,37.82 63.44,38.6 63.44,51.19 60.23,54.4 v60.23,56.23
  Bottom 0.406: U6.5 63.3,81.08 65.42,78.95 65.42,77.53 65.81,77.14 65.83,77.14 66.89,76.08 66.89,74.44 R7.2 66.17,74.39 65.3,73.51 63.97,73.51 60.23,69.78 v60.23,56.23 | U1.27 63.42,38.62 v64.22,37.82
TAB  (via drill 0.51)
  Bottom 0.254: U3.TAB 66.38,69.3 v66.42,69.34 | U3.TAB 66.38,64.37 v66.31,64.3 | 68.85,66.79 v68.81,66.83 U3.TAB | U3.TAB 64.48,66.83 v64.45,66.86
  pour Bottom (no thermals): 63.78,69.92 69.73,69.92 69.73,63.72 63.78,63.72
  pour Top: 63.92,69.84 69.67,69.84 69.67,63.72 63.92,63.72
TX_UART  (via drill 0.51)
  Top 0.406: v59.49,37.81 59.51,37.79 v59.51,32.22
  Bottom 0.406: U1.31 60.22,38.54 v59.49,37.81 | J6.1 61.1,30.63 v59.51,32.22
VBAT_3V  (via drill 0.51)
  Top 0.406: v58.05,79.77 48.13,69.85 43.57,69.85 | BH1.+$2 27.22,71.7 29.07,69.85 43.57,69.85 | BH1.+$1 43.62,69.9 43.57,69.85
  Bottom 0.406: U6.3 58.02,79.81 v58.05,79.77
VCC  (via drill 0.51)
  Top 0.406: v61.59,82.35 61.88,82.06 v61.88,74.86 63.3,73.44 v68.83,73.44 | J5.2 70.33,56.04 68.13,56.04 66.89,54.8 63.4,54.8
  Top 1.016: U4.P$4 82.09,52.26 80.43,50.6 v74.4,50.6 | v61.6,59.46 48.2,59.46 | 48.2,59.46 44.4,55.66 | 51.85,29.88 44.4,37.33 v44.4,42.62 44.4,55.66 | 51.85,29.88 69.09,29.88 74.4,35.19 v74.4,50.6 | v70.37,62.8 64.94,62.8 v61.6,59.46 | v74.4,50.6 71.99,53.01 65.18,53.01 63.4,54.8 61.6,56.59 v61.6,59.46 | 51.85,29.88 49.32,27.35 49.32,26.31 47.2,24.19 | v35.6,34.74 36.8,33.54 v36.8,26.54 39.15,24.19 47.2,24.19 | 44.4,55.66 41.96,55.66 28.96,68.66 K2.A2 22.71,70.35 15.63,70.35 13.89,68.61 K1.A2 | v61.88,74.86 59.12,72.1 59.12,66.69 61.6,64.21 v61.6,59.46 | 48.2,59.46 48.2,65.77 48.53,66.09 48.53,66.28 J2.2 | 47.2,24.19 49,22.39 J3.2
  Bottom 0.406: U10.8 36.53,35.91 C18.1 | U11.8 36.24,28.93 C20.1 | R8.1 64.67,72.39 R7.1 67.78,72.39 v68.83,73.44 | U6.8 62.3,77.27 R10.2 | U1.18 67.98,45.68 C4.1 | U1.4 57.92,43.27 C5.1 56.32,43.27 56.89,43.84 56.89,44.53 57.12,44.77 57.81,44.77 U1.6 | C16.1 60.75,83.19 v61.59,82.35 | R1.2 62.7,58.36 v61.6,59.46
  Bottom 1.016: C10.1 72.77,64.33 U3.3 72.09,64.52 v70.37,62.8 | v36.8,26.54 36.8,28.23 C20.1 | C18.1 36.25,35.39 v35.6,34.74 | v61.88,74.86 63.22,76.2 R10.2 | v74.4,50.6 72.9,50.6 70.05,47.75 70.05,47.66 69.47,47.08 69.38,47.08 C4.1 | C5.1 55.37,42.53 55.28,42.53 54.7,41.95 54.7,41.86 53.29,40.45 46.57,40.45 v44.4,42.62 | D2.C 24.4,67.91 K2.A2 | D1.C 10.71,69.5 K1.A2
  pour Top: 95.54,54.53 75.71,54.53 75.71,65.01 70.06,65 70.03,63.59 69.79,63.35 63.01,63.35 59.77,66.59 59.77,72.3 65.85,72.3 65.85,84.22 65.87,84.24 0.36,84.24 0.28,84.16 0.28,66.98 0.2,66.9 26.99,66.9 26.99,51.14 27.11,51.02 arc-90 27.15,51.06 32.55,51.06 32.55,21.06 68.54,21.06 75.32,27.84 75.32,49.76 95.49,49.76 95.49,54.52
VCC3.3  (via drill 0.51)
  Top 1.016: v68.65,70.64 68.57,70.56 62.81,70.56 C13.2
  Bottom 1.016: U5.2 81.04,60.87 R9.1 | R9.1 76.49,60.87 C12.1 | R9.1 79.17,65.25 77.51,66.91 C11.1 75.68,66.83 U3.2 71.69,66.83 70.54,67.98 70.54,69.36 69.26,70.64 v68.65,70.64
  pour Top: 95.61,55.29 95.61,62.67 78.57,62.67 78.57,71.73 60.31,71.73 60.31,66.78 63.2,63.88 63.57,64.25 63.57,70.19 70.06,70.19 70.06,65.58 76.22,65.58 76.22,55.44 76.62,55.04 95.36,55.04
VOUT1
  Bottom 0.406: U10.7 37.02,37.17 R13.2
VOUT2
  Bottom 0.406: U11.7 36.59,30.2 R15.2
X1
  Bottom 0.406: U6.1 55.12,77.27 Y2.2 51.7,77.92 C15.1
X2
  Bottom 0.406: U6.2 55.26,78.53 54.4,79.39 54.4,80.52 Y2.1 53.08,81.91 51.92,83.07 C14.1
XTAL1
  Bottom 0.406: U1.7 52.82,45.68 51.91,44.77 Y1.1 51.4,44.26 C1.1
XTAL2
  Bottom 0.406: U1.8 51.73,52.68 Y1.2 51.22,54.6 C2.1

### Text on the board
tPlace: L | N | L | N | L | N | SOCKET BOTTOM | SOCKET TOP | AC IN | v1.0